# EAGLE schematic EurocardBackplane-V1_0 (EAGLE 6.5.0)

## Sheet 1 of 2
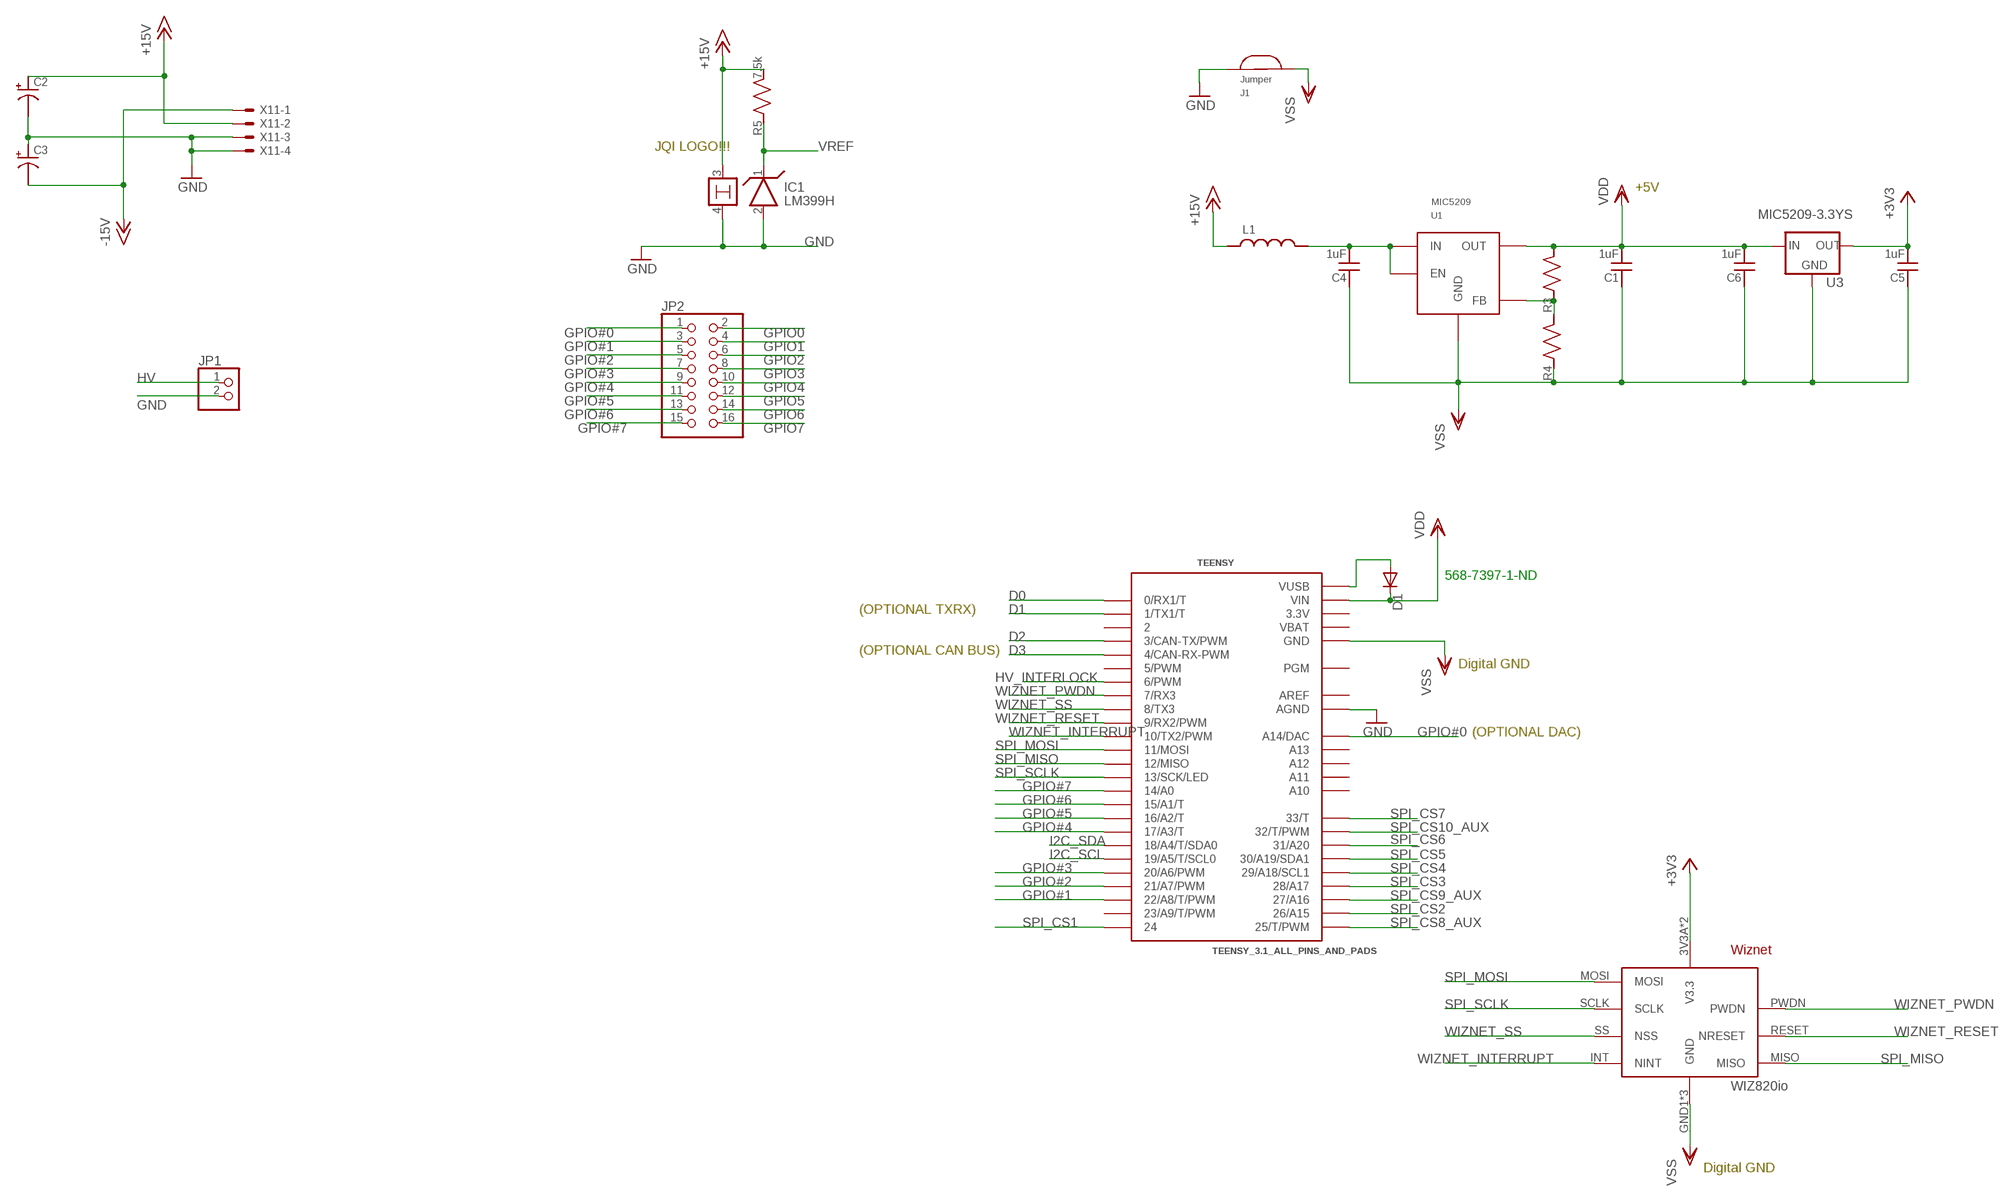
[diagram p0: schematic, sheet 1]

### Parts
C1  1uF  C_MLCC_SMDCMLCC_0603  [C_MLCC_0603]
C2  C_POL_SMDF  [PANASONIC_F]
C3  C_POL_SMDF  [PANASONIC_F]
C4  1uF  C_MLCC_SMDCMLCC_0603  [C_MLCC_0603]
C5  1uF  C_MLCC_SMDCMLCC_0603  [C_MLCC_0603]
C6  1uF  C_MLCC_SMDCMLCC_0603  [C_MLCC_0603]
D1  DIODE-SOD523  [SOD523]
IC1  LM399H  [TO39/4]
J1  JUMPER  [JUMP]
JP1  PINHD-1X2  [1X02]
JP2  PINHD-2X8  [2X08]
L1  L_FERRITE_SMDLFERRITE_0805  [R_0805]
R3  R_SMDR0603  [R_0603]
R4  R_SMDR0603  [R_0603]
R5  7.5k  R_SMDR0603  [R_0603]
TEENSY  TEENSY_3.1_ALL_PINS_AND_PADS  [TEENSY_3.1_ALLPINS]
U1  MIC5209  [TO263-5]
U2  WIZ820IO  [WIZNET]
U3  MIC5209-3.3YS  MIC5209-FIXED  [SOT223-S]
X11  5566-4  [5566-4]

### Nets
+3V3: C5.P$2 U2.3V3A(V3.3) U2.3V3B(V3.3) U3.3(OUT)
+15V: C2.+ IC1.3 L1.P$1 R5.P$2 X11.2 ; also sheet 2
-15V: C3.- X11.1 ; also sheet 2
D0: TEENSY.0(0/RX1/T) ; also sheet 2
D1: TEENSY.1(1/TX1/T) ; also sheet 2
D2: TEENSY.3(3/CAN-TX/PWM) ; also sheet 2
D3: TEENSY.4(4/CAN-RX-PWM) ; also sheet 2
GND: C2.- C3.+ IC1.2 IC1.4 J1.P$2 JP1.2 TEENSY.AGND X11.3 X11.4 ; also sheet 2
GPIO0: JP2.2 ; also sheet 2
GPIO1: JP2.4 ; also sheet 2
GPIO2: JP2.6 ; also sheet 2
GPIO3: JP2.8 ; also sheet 2
GPIO4: JP2.10 ; also sheet 2
GPIO5: JP2.12 ; also sheet 2
GPIO6: JP2.14 ; also sheet 2
GPIO7: JP2.16 ; also sheet 2
GPIO#0: JP2.1 TEENSY.A14(A14/DAC)
GPIO#1: JP2.3 TEENSY.22/A8(22/A8/T/PWM)
GPIO#2: JP2.5 TEENSY.21/A7(21/A7/PWM)
GPIO#3: JP2.7 TEENSY.20/A6(20/A6/PWM)
GPIO#4: JP2.9 TEENSY.17/A3(17/A3/T)
GPIO#5: JP2.11 TEENSY.16/A2(16/A2/T)
GPIO#6: JP2.13 TEENSY.15/A1(15/A1/T)
GPIO#7: JP2.15 TEENSY.14/A0
HV: JP1.1 ; also sheet 2
HV_INTERLOCK: TEENSY.6(6/PWM) ; also sheet 2
I2C_SCL: TEENSY.19/A5(19/A5/T/SCL0) ; also sheet 2
I2C_SDA: TEENSY.18/A4(18/A4/T/SDA0) ; also sheet 2
N$1: C4.P$2 L1.P$2 U1.1(EN) U1.2(IN)
N$2: D1.A TEENSY.VUSB
N$5: R3.P$1 R4.P$2 U1.5(FB)
SPI_CS1: TEENSY.24 ; also sheet 2
SPI_CS2: TEENSY.26(26/A15) ; also sheet 2
SPI_CS3: TEENSY.28(28/A17) ; also sheet 2
SPI_CS4: TEENSY.29(29/A18/SCL1) ; also sheet 2
SPI_CS5: TEENSY.30(30/A19/SDA1) ; also sheet 2
SPI_CS6: TEENSY.31(31/A20) ; also sheet 2
SPI_CS7: TEENSY.33(33/T) ; also sheet 2
SPI_CS8_AUX: TEENSY.25(25/T/PWM) ; also sheet 2
SPI_CS9_AUX: TEENSY.27(27/A16) ; also sheet 2
SPI_CS10_AUX: TEENSY.32(32/T/PWM) ; also sheet 2
SPI_MISO: TEENSY.12(12/MISO) U2.MISO ; also sheet 2
SPI_MOSI: TEENSY.11(11/MOSI) U2.MOSI ; also sheet 2
SPI_SCLK: TEENSY.13(13/SCK/LED) U2.SCLK ; also sheet 2
VDD: C1.P$2 C6.P$2 D1.C R3.P$2 TEENSY.VIN U1.4(OUT) U3.1(IN)
VREF: IC1.1 R5.P$1 ; also sheet 2
VSS: C1.P$1 C4.P$1 C5.P$1 C6.P$1 J1.P$1 R4.P$1 TEENSY.GND TEENSY.GND1(GND) TEENSY.GND2(GND) U1.3(GND) U1.6(GND) U2.GND1(GND) U2.GND2(GND) U2.GND3(GND) U3.2(GND) U3.4(GND)
WIZNET_INTERRUPT: TEENSY.10(10/TX2/PWM) U2.INT(NINT)
WIZNET_PWDN: TEENSY.7(7/RX3) U2.PWDN
WIZNET_RESET: TEENSY.9(9/RX2/PWM) U2.RESET(NRESET)
WIZNET_SS: TEENSY.8(8/TX3) U2.SS(NSS)
Unconnected: TEENSY.2 TEENSY.5(5/PWM) TEENSY.23/A9(23/A9/T/PWM) TEENSY.A10 TEENSY.A11 TEENSY.A12 TEENSY.A13 TEENSY.PGM

### Notes on the sheet
- JQI LOGO!!!
- +5V
- 568-7397-1-ND
- (OPTIONAL TXRX)
- (OPTIONAL CAN BUS)
- Digital GND
- (OPTIONAL DAC)
- Digital GND

## Sheet 2 of 2
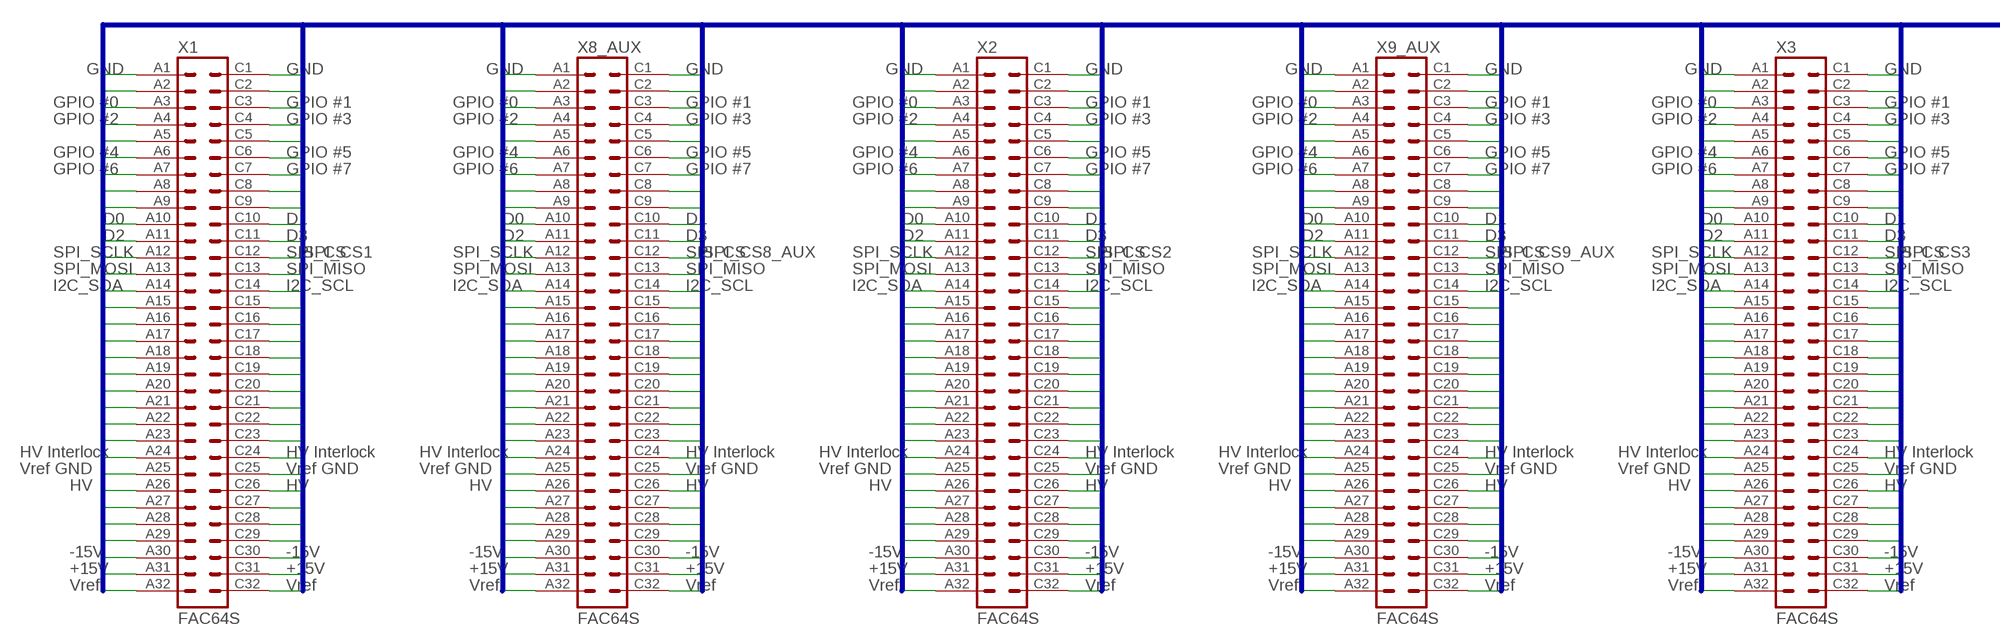
[diagram p1: schematic, sheet 2, part 1 of 2]
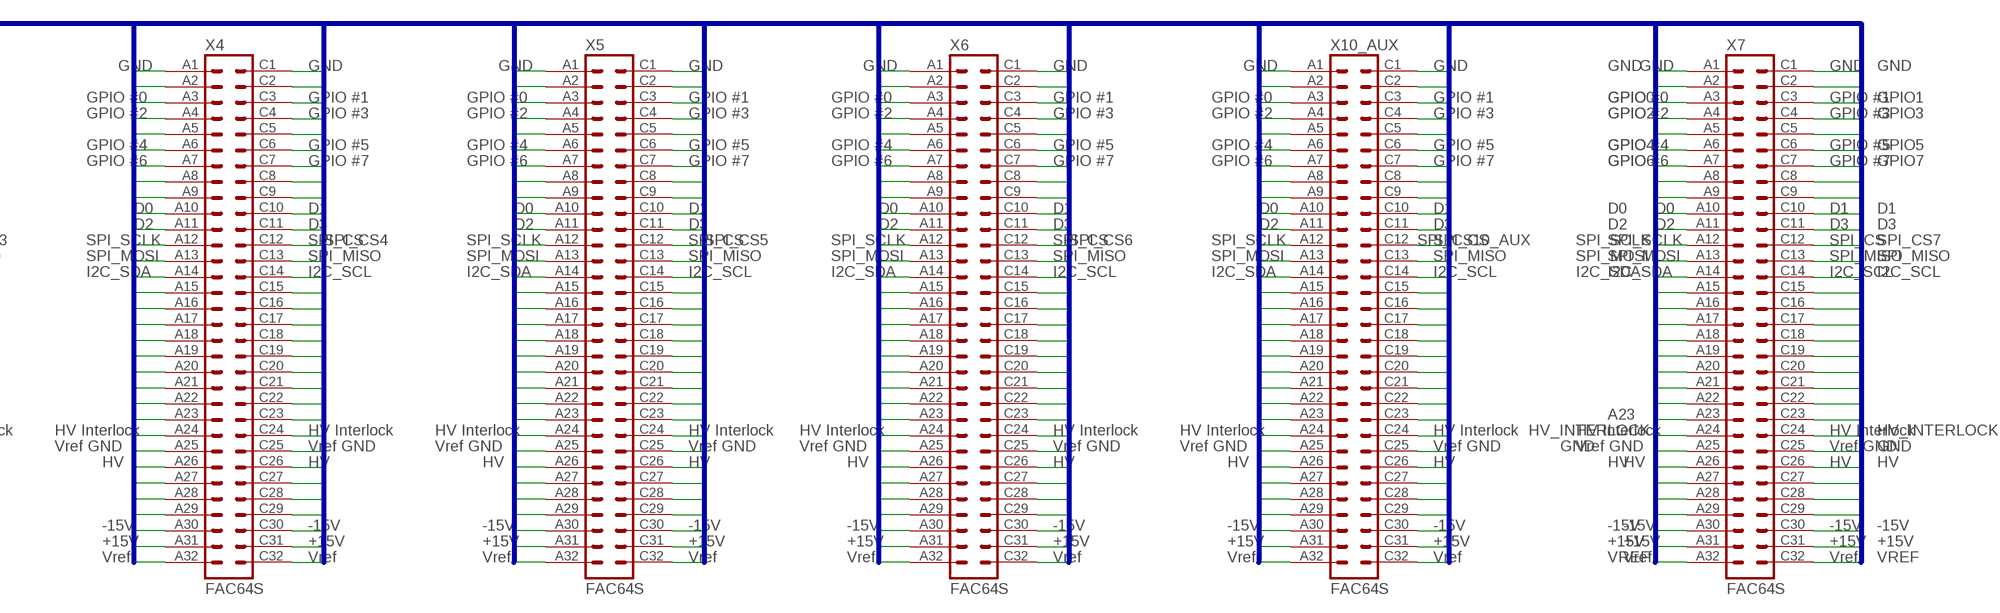
[diagram p2: schematic, sheet 2, part 2 of 2]

### Parts
X1  FAC64S  [FAC64S]
X2  FAC64S  [FAC64S]
X3  FAC64S  [FAC64S]
X4  FAC64S  [FAC64S]
X5  FAC64S  [FAC64S]
X6  FAC64S  [FAC64S]
X7  FAC64S  [FAC64S]
X8_AUX  FAC64S  [FAC64S]
X9_AUX  FAC64S  [FAC64S]
X10_AUX  FAC64S  [FAC64S]

### Nets
+15V: X1.A31 X1.C31 X2.A31 X2.C31 X3.A31 X3.C31 X4.A31 X4.C31 X5.A31 X5.C31 X6.A31 X6.C31 X7.A31 X7.C31 X8_AUX.A31 X8_AUX.C31 X9_AUX.A31 X9_AUX.C31 X10_AUX.A31 X10_AUX.C31 ; also sheet 1
-15V: X1.A30 X1.C30 X2.A30 X2.C30 X3.A30 X3.C30 X4.A30 X4.C30 X5.A30 X5.C30 X6.A30 X6.C30 X7.A30 X7.C30 X8_AUX.A30 X8_AUX.C30 X9_AUX.A30 X9_AUX.C30 X10_AUX.A30 X10_AUX.C30 ; also sheet 1
A2: X1.A2 X2.A2 X3.A2 X4.A2 X5.A2 X6.A2 X7.A2 X8_AUX.A2 X9_AUX.A2 X10_AUX.A2
A5: X1.A5 X2.A5 X3.A5 X4.A5 X5.A5 X6.A5 X7.A5 X8_AUX.A5 X9_AUX.A5 X10_AUX.A5
A8: X1.A8 X2.A8 X3.A8 X4.A8 X5.A8 X6.A8 X7.A8 X8_AUX.A8 X9_AUX.A8 X10_AUX.A8
A9: X1.A9 X2.A9 X3.A9 X4.A9 X5.A9 X6.A9 X7.A9 X8_AUX.A9 X9_AUX.A9 X10_AUX.A9
A15: X1.A15 X2.A15 X3.A15 X4.A15 X5.A15 X6.A15 X7.A15 X8_AUX.A15 X9_AUX.A15 X10_AUX.A15
A16: X1.A16 X2.A16 X3.A16 X4.A16 X5.A16 X6.A16 X7.A16 X8_AUX.A16 X9_AUX.A16 X10_AUX.A16
A17: X1.A17 X2.A17 X3.A17 X4.A17 X5.A17 X6.A17 X7.A17 X8_AUX.A17 X9_AUX.A17 X10_AUX.A17
A18: X1.A18 X2.A18 X3.A18 X4.A18 X5.A18 X6.A18 X7.A18 X8_AUX.A18 X9_AUX.A18 X10_AUX.A18
A19: X1.A19 X2.A19 X3.A19 X4.A19 X5.A19 X6.A19 X7.A19 X8_AUX.A19 X9_AUX.A19 X10_AUX.A19
A20: X1.A20 X2.A20 X3.A20 X4.A20 X5.A20 X6.A20 X7.A20 X8_AUX.A20 X9_AUX.A20 X10_AUX.A20
A21: X1.A21 X2.A21 X3.A21 X4.A21 X5.A21 X6.A21 X7.A21 X8_AUX.A21 X9_AUX.A21 X10_AUX.A21
A22: X1.A22 X2.A22 X3.A22 X4.A22 X5.A22 X6.A22 X7.A22 X8_AUX.A22 X9_AUX.A22 X10_AUX.A22
A23: X1.A23 X2.A23 X3.A23 X4.A23 X5.A23 X6.A23 X7.A23 X8_AUX.A23 X9_AUX.A23 X10_AUX.A23
A27: X1.A27 X2.A27 X3.A27 X4.A27 X5.A27 X6.A27 X7.A27 X8_AUX.A27 X9_AUX.A27 X10_AUX.A27
A28: X1.A28 X2.A28 X3.A28 X4.A28 X5.A28 X6.A28 X7.A28 X8_AUX.A28 X9_AUX.A28 X10_AUX.A28
A29: X1.A29 X2.A29 X3.A29 X4.A29 X5.A29 X6.A29 X7.A29 X8_AUX.A29 X9_AUX.A29 X10_AUX.A29
C2: X1.C2 X2.C2 X3.C2 X4.C2 X5.C2 X6.C2 X7.C2 X8_AUX.C2 X9_AUX.C2 X10_AUX.C2
C5: X1.C5 X2.C5 X3.C5 X4.C5 X5.C5 X6.C5 X7.C5 X8_AUX.C5 X9_AUX.C5 X10_AUX.C5
C8: X1.C8 X2.C8 X3.C8 X4.C8 X5.C8 X6.C8 X7.C8 X8_AUX.C8 X9_AUX.C8 X10_AUX.C8
C9: X1.C9 X2.C9 X3.C9 X4.C9 X5.C9 X6.C9 X7.C9 X8_AUX.C9 X9_AUX.C9 X10_AUX.C9
C15: X1.C15 X2.C15 X3.C15 X4.C15 X5.C15 X6.C15 X7.C15 X8_AUX.C15 X9_AUX.C15 X10_AUX.C15
C16: X1.C16 X2.C16 X3.C16 X4.C16 X5.C16 X6.C16 X7.C16 X8_AUX.C16 X9_AUX.C16 X10_AUX.C16
C17: X1.C17 X2.C17 X3.C17 X4.C17 X5.C17 X6.C17 X7.C17 X8_AUX.C17 X9_AUX.C17 X10_AUX.C17
C18: X1.C18 X2.C18 X3.C18 X4.C18 X5.C18 X6.C18 X7.C18 X8_AUX.C18 X9_AUX.C18 X10_AUX.C18
C19: X1.C19 X2.C19 X3.C19 X4.C19 X5.C19 X6.C19 X7.C19 X8_AUX.C19 X9_AUX.C19 X10_AUX.C19
C20: X1.C20 X2.C20 X3.C20 X4.C20 X5.C20 X6.C20 X7.C20 X8_AUX.C20 X9_AUX.C20 X10_AUX.C20
C21: X1.C21 X2.C21 X3.C21 X4.C21 X5.C21 X6.C21 X7.C21 X8_AUX.C21 X9_AUX.C21 X10_AUX.C21
C22: X1.C22 X2.C22 X3.C22 X4.C22 X5.C22 X6.C22 X7.C22 X8_AUX.C22 X9_AUX.C22 X10_AUX.C22
C23: X1.C23 X2.C23 X3.C23 X4.C23 X5.C23 X6.C23 X7.C23 X8_AUX.C23 X9_AUX.C23 X10_AUX.C23
C27: X1.C27 X2.C27 X3.C27 X4.C27 X5.C27 X6.C27 X7.C27 X8_AUX.C27 X9_AUX.C27 X10_AUX.C27
C28: X1.C28 X2.C28 X3.C28 X4.C28 X5.C28 X6.C28 X7.C28 X8_AUX.C28 X9_AUX.C28 X10_AUX.C28
C29: X1.C29 X2.C29 X3.C29 X4.C29 X5.C29 X6.C29 X7.C29 X8_AUX.C29 X9_AUX.C29 X10_AUX.C29
D0: X1.A10 X2.A10 X3.A10 X4.A10 X5.A10 X6.A10 X7.A10 X8_AUX.A10 X9_AUX.A10 X10_AUX.A10 ; also sheet 1
D1: X1.C10 X2.C10 X3.C10 X4.C10 X5.C10 X6.C10 X7.C10 X8_AUX.C10 X9_AUX.C10 X10_AUX.C10 ; also sheet 1
D2: X1.A11 X2.A11 X3.A11 X4.A11 X5.A11 X6.A11 X7.A11 X8_AUX.A11 X9_AUX.A11 X10_AUX.A11 ; also sheet 1
D3: X1.C11 X2.C11 X3.C11 X4.C11 X5.C11 X6.C11 X7.C11 X8_AUX.C11 X9_AUX.C11 X10_AUX.C11 ; also sheet 1
GND: X1.A1 X1.A25 X1.C1 X1.C25 X2.A1 X2.A25 X2.C1 X2.C25 X3.A1 X3.A25 X3.C1 X3.C25 X4.A1 X4.A25 X4.C1 X4.C25 X5.A1 X5.A25 X5.C1 X5.C25 X6.A1 X6.A25 X6.C1 X6.C25 X7.A1 X7.A25 X7.C1 X7.C25 X8_AUX.A1 X8_AUX.A25 X8_AUX.C1 X8_AUX.C25 X9_AUX.A1 X9_AUX.A25 X9_AUX.C1 X9_AUX.C25 X10_AUX.A1 X10_AUX.A25 X10_AUX.C1 X10_AUX.C25 ; also sheet 1
GPIO0: X1.A3 X2.A3 X3.A3 X4.A3 X5.A3 X6.A3 X7.A3 X8_AUX.A3 X9_AUX.A3 X10_AUX.A3 ; also sheet 1
GPIO1: X1.C3 X2.C3 X3.C3 X4.C3 X5.C3 X6.C3 X7.C3 X8_AUX.C3 X9_AUX.C3 X10_AUX.C3 ; also sheet 1
GPIO2: X1.A4 X2.A4 X3.A4 X4.A4 X5.A4 X6.A4 X7.A4 X8_AUX.A4 X9_AUX.A4 X10_AUX.A4 ; also sheet 1
GPIO3: X1.C4 X2.C4 X3.C4 X4.C4 X5.C4 X6.C4 X7.C4 X8_AUX.C4 X9_AUX.C4 X10_AUX.C4 ; also sheet 1
GPIO4: X1.A6 X2.A6 X3.A6 X4.A6 X5.A6 X6.A6 X7.A6 X8_AUX.A6 X9_AUX.A6 X10_AUX.A6 ; also sheet 1
GPIO5: X1.C6 X2.C6 X3.C6 X4.C6 X5.C6 X6.C6 X7.C6 X8_AUX.C6 X9_AUX.C6 X10_AUX.C6 ; also sheet 1
GPIO6: X1.A7 X2.A7 X3.A7 X4.A7 X5.A7 X6.A7 X7.A7 X8_AUX.A7 X9_AUX.A7 X10_AUX.A7 ; also sheet 1
GPIO7: X1.C7 X2.C7 X3.C7 X4.C7 X5.C7 X6.C7 X7.C7 X8_AUX.C7 X9_AUX.C7 X10_AUX.C7 ; also sheet 1
HV: X1.A26 X1.C26 X2.A26 X2.C26 X3.A26 X3.C26 X4.A26 X4.C26 X5.A26 X5.C26 X6.A26 X6.C26 X7.A26 X7.C26 X8_AUX.A26 X8_AUX.C26 X9_AUX.A26 X9_AUX.C26 X10_AUX.A26 X10_AUX.C26 ; also sheet 1
HV_INTERLOCK: X1.A24 X1.C24 X2.A24 X2.C24 X3.A24 X3.C24 X4.A24 X4.C24 X5.A24 X5.C24 X6.A24 X6.C24 X7.A24 X7.C24 X8_AUX.A24 X8_AUX.C24 X9_AUX.A24 X9_AUX.C24 X10_AUX.A24 X10_AUX.C24 ; also sheet 1
I2C_SCL: X1.C14 X2.C14 X3.C14 X4.C14 X5.C14 X6.C14 X7.C14 X8_AUX.C14 X9_AUX.C14 X10_AUX.C14 ; also sheet 1
I2C_SDA: X1.A14 X2.A14 X3.A14 X4.A14 X5.A14 X6.A14 X7.A14 X8_AUX.A14 X9_AUX.A14 X10_AUX.A14 ; also sheet 1
SPI_CS1: X1.C12 ; also sheet 1
SPI_CS2: X2.C12 ; also sheet 1
SPI_CS3: X3.C12 ; also sheet 1
SPI_CS4: X4.C12 ; also sheet 1
SPI_CS5: X5.C12 ; also sheet 1
SPI_CS6: X6.C12 ; also sheet 1
SPI_CS7: X7.C12 ; also sheet 1
SPI_CS8_AUX: X8_AUX.C12 ; also sheet 1
SPI_CS9_AUX: X9_AUX.C12 ; also sheet 1
SPI_CS10_AUX: X10_AUX.C12 ; also sheet 1
SPI_MISO: X1.C13 X2.C13 X3.C13 X4.C13 X5.C13 X6.C13 X7.C13 X8_AUX.C13 X9_AUX.C13 X10_AUX.C13 ; also sheet 1
SPI_MOSI: X1.A13 X2.A13 X3.A13 X4.A13 X5.A13 X6.A13 X7.A13 X8_AUX.A13 X9_AUX.A13 X10_AUX.A13 ; also sheet 1
SPI_SCLK: X1.A12 X2.A12 X3.A12 X4.A12 X5.A12 X6.A12 X7.A12 X8_AUX.A12 X9_AUX.A12 X10_AUX.A12 ; also sheet 1
VREF: X1.A32 X1.C32 X2.A32 X2.C32 X3.A32 X3.C32 X4.A32 X4.C32 X5.A32 X5.C32 X6.A32 X6.C32 X7.A32 X7.C32 X8_AUX.A32 X8_AUX.C32 X9_AUX.A32 X9_AUX.C32 X10_AUX.A32 X10_AUX.C32 ; also sheet 1

### Buses
A[1..32],C[1..32]

## Power pins joined to a net without a drawn wire
3.3V: TEENSY.3.3V TEENSY.3.3V1(3.3V) TEENSY.3.3V2(3.3V)
AREF: TEENSY.AREF
VBAT: TEENSY.VBAT

## Library data of the parts
C1 C4-C6 = jqi_passives:C_MLCC_SMD
C2 C3 = jqi_passives:C_POL_SMD
D1 = diode:DIODE-: DIODE
IC1 = Eurocard-Backplane-jqi:LM399H: Precision Z DIODE
J1 = Eurocard-Backplane-jqi:JUMPER
JP1 = pinhead:PINHD-1X2: PIN HEADER
JP2 = pinhead:PINHD-2X8: PIN HEADER
L1 = jqi_passives:L_FERRITE_SMD
R3-R5 = jqi_passives:R_SMD
TEENSY = mcu-accessories:TEENSY_3.1_ALL_PINS_AND_PADS: Footprint for Teensy 3.1 board using all pads and all through-holes. Pads need a 2x7 0.1" SMD header.
U1 = regulator-jqi:MIC5209: MIC5209YU Adjustable regulator, 500mA. Vout = 1.242(1+R2/R1), R2 less than 470k (top of divider partition).
U2 = mcu-accessories:WIZ820IO: WIZNET ethernet eval board
U3 = regulator-jqi:MIC5209-FIXED: MIC5209 positive fixed Vreg, 500mA
X1-X7 X8_AUX X9_AUX X10_AUX = Eurocard-Backplane-jqi:FAC64S: CONNECTOR female, 64 pins, block, type C, rows AC, grid 5.08 mm
X11 = Eurocard-Backplane-jqi:5566-4: Mini FIT connector 4 pol Source: http://www.molex.com; OC_FARNELL: unknown; OC_NEWARK: unknown